# Altium project Delenda.PrjPcb
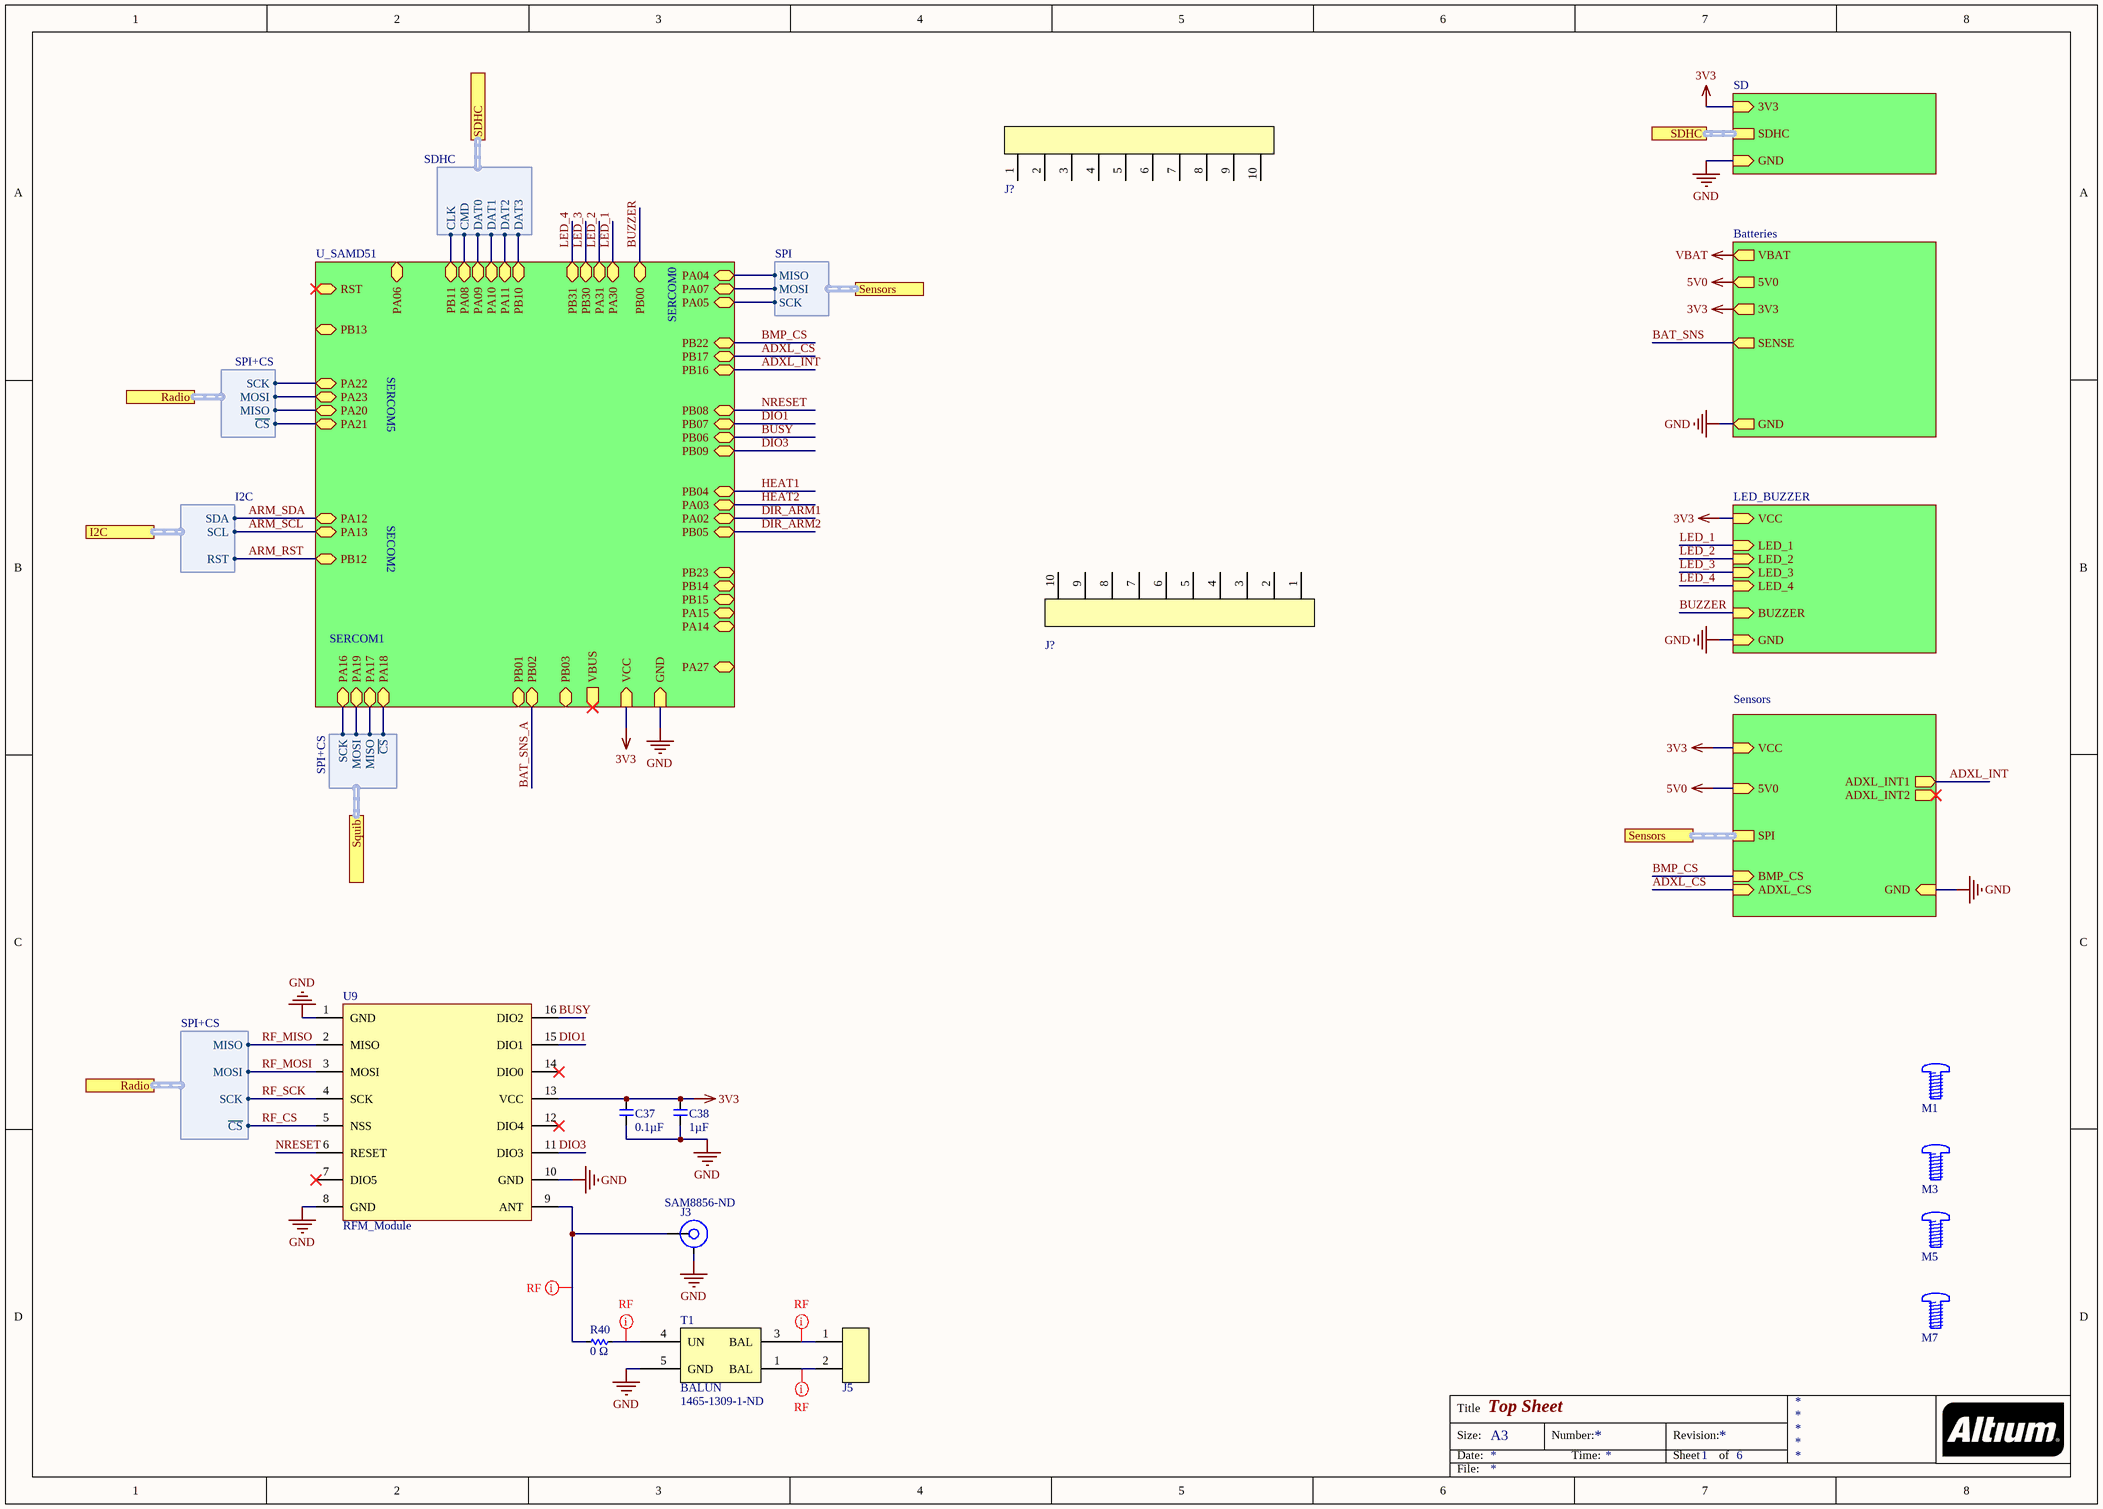
[diagram p0: Delenda.SchDoc]
prjEngineer1: John Dean; prjEngineer2: Rebecca Wong; prjReviewDate: 2016-10-31; prjReviewer: Sasha Maldonado; prjRevision: 0; prjTitle: IREC SRAD Altimeter
6 sheets, 83 parts. Net scope: strictly hierarchical (ports join the sheet entries above them; power ports are local).
Board file: Delenda.PcbDoc
Sheets:
  Delenda.SchDoc
    Sensors = Sensors.SchDoc
    Batteries = Battery_Management.SchDoc
    LED_BUZZER = Blink_Blink_Beep_Boop.SchDoc
    U_SAMD51 = SAMD51.SchDoc
    SD = SD.SchDoc

## Sheet Delenda.SchDoc: Top Sheet
size A3; SheetNumber: 1; SheetTotal: 6; DocumentName: Top Sheet

### Parts
(Parts that share a designator on the sheet are numbered #1, #2 ... from top to bottom, then left to right.)
C37  Capacitance (shorthand): 0.1µF  [C0603]  (hidden comment: __template_cap)
C38  Capacitance (shorthand): 1µF  [C0603]  (hidden comment: __template_cap)
J3  Supplier Part Number 1: SAM8856-ND  [SMA_SAMTEC_SMA-J-P-X-RA-TH1]  (hidden comment: SMA_SAMTEC_TH_RA)
J5  CONN HEADER 2POS VERT T/H  [CONN_1x2_100MIL]  (value not drawn)
J?#1  CONN HEADER 10POS T/H  [CONN_1x10_100MIL]  (value not drawn)
J?#2  CONN HEADER 10POS T/H  [CONN_1x10_100MIL]  (value not drawn)
M1  SCREW_#4-40  [#4_HOLE]  (value not drawn)
M3  SCREW_#4-40  [#4_HOLE]  (value not drawn)
M5  SCREW_#4-40  [#4_HOLE]  (value not drawn)
M7  SCREW_#4-40  [#4_HOLE]  (value not drawn)
R40  Resistance: 0 Ω  [R0402]  (hidden comment: __template_resistor)
T1  BALUN  Supplier Part Number 1: 1465-1309-1-ND  [BALUN_MABA-010245-CT1160]
U9  RFM_Module  [RFM-22]

### Sub-sheets
Batteries = Battery_Management: SENSE (out), 5V0 (out), GND (out), 3V3 (out), VBAT (out)
LED_BUZZER = Blink_Blink_Beep_Boop: LED_1 (in), LED_2 (in), LED_3 (in), LED_4 (in), BUZZER (in), GND (in), VCC (in)
SD = SD.SchDoc: SDHC (harness SDHC), GND (in), 3V3 (in)
Sensors = Sensors.SchDoc: SPI (harness SPI), BMP_CS (in), ADXL_CS (in), ADXL_INT1 (out), ADXL_INT2 (out), GND (in), VCC (in), 5V0 (in)
U_SAMD51 = SAMD51.SchDoc: PA12 (bidir), PA13 (bidir), PA05 (bidir), PA07 (bidir), PA04 (bidir), PA06 (bidir), PB11 (bidir), PA08 (bidir), PA09 (bidir), PA10 (bidir), PA11 (bidir), PB10 (bidir), PB12 (bidir), PB13 (bidir), PA22 (bidir), PA23 (bidir), PA16 (bidir), PA19 (bidir), PA17 (bidir), PA20 (bidir), PA21 (bidir), PB08 (bidir), PB07 (bidir), PB06 (bidir), PB09 (bidir), PB04 (bidir), PA03 (bidir), PA02 (bidir), PB05 (bidir), PB00 (bidir), PB30 (bidir), PA31 (bidir), PA30 (bidir), PB31 (bidir), PB16 (bidir), PA14 (bidir), PB17 (bidir), PB23 (bidir), PB22 (bidir), PA27 (bidir), PB02 (bidir), PB01 (bidir), PB03 (bidir), PA18 (bidir), GND (in), VCC (in), VBUS (out), PB14 (bidir), PB15 (bidir), PA15 (bidir), RST (bidir)

### Ports
I2C (harness I2C), Radio (harness SPI+CS), SDHC, SDHC (harness SDHC), Sensors (harness SPI), Squib (harness SPI+CS)

### Harnesses
SPI: MISO, MOSI, SCK
SDHC: CLK, CMD, DAT0, DAT1, DAT2, DAT3
SPI+CS: MISO, MOSI, SCK, ~{CS}
I2C: SCL, SDA, RST

### Nets
3V3: C37.1 C38.1 U9.13(VCC) ; sheet Sensors/VCC, sheet Batteries/3V3, sheet LED_BUZZER/VCC, sheet U_SAMD51/VCC, sheet SD/3V3
5V0: sheet Sensors/5V0, sheet Batteries/5V0
GND: C37.2 C38.2 J3.GND T1.5(GND) U9.1(GND) U9.8(GND) U9.10(GND) ; sheet Sensors/GND, sheet Batteries/GND, sheet LED_BUZZER/GND, sheet U_SAMD51/GND, sheet SD/GND
ADXL_CS: sheet Sensors/ADXL_CS, sheet U_SAMD51/PB17
ADXL_INT: sheet Sensors/ADXL_INT1, sheet U_SAMD51/PB16
ARM_RST: sheet U_SAMD51/PB12, port I2C.RST
ARM_SCL: sheet U_SAMD51/PA13, port I2C.SCL
ARM_SDA: sheet U_SAMD51/PA12, port I2C.SDA
BMP_CS: sheet Sensors/BMP_CS, sheet U_SAMD51/PB22
BUSY: U9.16(DIO2) ; sheet U_SAMD51/PB06
BUZZER: sheet LED_BUZZER/BUZZER, sheet U_SAMD51/PB00
DIO1: U9.15(DIO1) ; sheet U_SAMD51/PB07
DIO3: U9.11(DIO3) ; sheet U_SAMD51/PB09
LED_1: sheet LED_BUZZER/LED_1, sheet U_SAMD51/PA30
LED_2: sheet LED_BUZZER/LED_2, sheet U_SAMD51/PA31
LED_3: sheet LED_BUZZER/LED_3, sheet U_SAMD51/PB30
LED_4: sheet LED_BUZZER/LED_4, sheet U_SAMD51/PB31
MISO: sheet U_SAMD51/PA04, port Sensors.MISO
MOSI: sheet U_SAMD51/PA07, port Sensors.MOSI
NRESET: U9.6(RESET) ; sheet U_SAMD51/PB08
RF_CS: U9.5(NSS) ; sheet U_SAMD51/PA21, port Radio.~{CS}
RF_MISO: U9.2(MISO) ; sheet U_SAMD51/PA20, port Radio.MISO
RF_MOSI: U9.3(MOSI) ; sheet U_SAMD51/PA23, port Radio.MOSI
RF_SCK: U9.4(SCK) ; sheet U_SAMD51/PA22, port Radio.SCK
SCK: sheet U_SAMD51/PA05, port Sensors.SCK
SD_CLK: sheet U_SAMD51/PB11, port SDHC.CLK
SD_CMD: sheet U_SAMD51/PA08, port SDHC.CMD
SD_DAT0: sheet U_SAMD51/PA09, port SDHC.DAT0
SD_DAT1: sheet U_SAMD51/PA10, port SDHC.DAT1
SD_DAT2: sheet U_SAMD51/PA11, port SDHC.DAT2
SD_DAT3: sheet U_SAMD51/PB10, port SDHC.DAT3
NetJ3_SIG: J3.SIG R40.1 U9.9(ANT)
NetJ5_1: J5.1 T1.3(BAL)
NetJ5_2: J5.2 T1.1(BAL)
NetR40_2: R40.2 T1.4(UN)
NetU7_35: sheet U_SAMD51/PA16, port Squib.SCK
NetU7_36: sheet U_SAMD51/PA17, port Squib.MISO
NetU7_37: sheet U_SAMD51/PA18, port Squib.~{CS}
NetU7_38: sheet U_SAMD51/PA19, port Squib.MOSI

Not connected (* = marked no-connect by the designer): J?#1 1 2 3 4 5 6 7 8 9 10; J?#2 1 2 3 4 5 6 7 8 9 10; M1 HOLE(0); M3 HOLE(0); M5 HOLE(0); M7 HOLE(0); U9 7(DIO5)* 12(DIO4)* 14(DIO0)*

### Buses and harness runs
harness port SDHC = sheet SD/SDHC
harness port Sensors = sheet Sensors/SPI

### Layout directives
rule Clearance Constraint [Generic clearance = 0mil, and 21 value(s) for objects]: NetJ3_SIG, NetJ5_1, NetJ5_2, NetR40_2

### Notes on the sheet
- SERCOM0
- SERCOM5
- SECOM2
- SERCOM1
- Title
- Size:
- Date:
- A3
- Number:
- Time:
- Revision:
- Sheet
- of
- File:

### Library data of the parts
C37 = 490-1519-1-ND: CAP CER 0603 0.1µF X7R 50V 10%; Manufacturer: Murata Electronics North America; Capacitance - pF (Machine readable): #NAME?; type: capacitor; Rated Voltage: 50V; Supplier Part Number 1: 490-1519-1-ND; Dielectric: X7R; Supplier 1: Digikey
C38 = 490-3900-1-ND: CAP CER 0603 1µF X7R 16V 10%; Manufacturer: Murata Electronics North America; Capacitance - pF (Machine readable): #NAME?; type: capacitor; Rated Voltage: 16V; Supplier Part Number 1: 490-3900-1-ND; Dielectric: X7R; Supplier 1: Digikey
J5 = CONN_1x2: Manufacturer: FCI; Manufacturer Part Number: 77311-118-02LF; Connector Type: Header, Unshrouded; Number of Positions: 2; Number of Positions Loaded: All; Pitch: 0.100" (2.54mm); RoHS: RoHS Compliant; Category: Connectors, Interconnects; Contact Type: Male Pin; Number of Rows: 1; Row Spacing: -; Contact Mating Length: 0.230" (5.84mm); Mounting Type: Through Hole; Termination: Solder; Fastening Type: -; Features: -; Contact Finish: Gold, GXT™; Contact Finish Thickness: 30µin (0.76µm); Color: Black; Packaging: Bulk; ComponentLink1URL: http://portal.fciconnect.com/res/en/pdffiles/doc_search//77311.pdf; ComponentLink1Description: http://portal.fciconnect.com/res/en/pdffiles/doc_search//77311.pdf
J?#1 J?#2 = CONN_1x10
M1 M3 M5 M7 = SCREW_#4-40: #4-40 Button Head Screw
R40 = 311-0.0LRCT-ND: RES SMD 0 OHM JUMPER 1/16W 0402; Manufacturer Part Number: RC0402FR-070RL; Manufacturer: Yageo; Resistance (Sortable): 0; Power (Watts): 0.063W, 1/16W; Supplier Part Number 1: 311-0.0LRCT-ND; Supplier 1: Digikey; Datasheets: http://www.yageo.com/documents/recent/PYu-RC_Group_51_RoHS_L_9.pdf; Image: //media.digikey.com/Renders/Yageo%20Renders/0402-(1005-Metric).jpg; Tolerance: Jumper; Temperature Coefficient: -; Operating Temperature: -55°C ~ 155°C
J3 = SMA_SAMTEC_TH_RA: Supplier 1: Digi-Key
T1 = BALUN: Supplier 1: Digi-Key

## Sheet Sensors.SchDoc
size A4
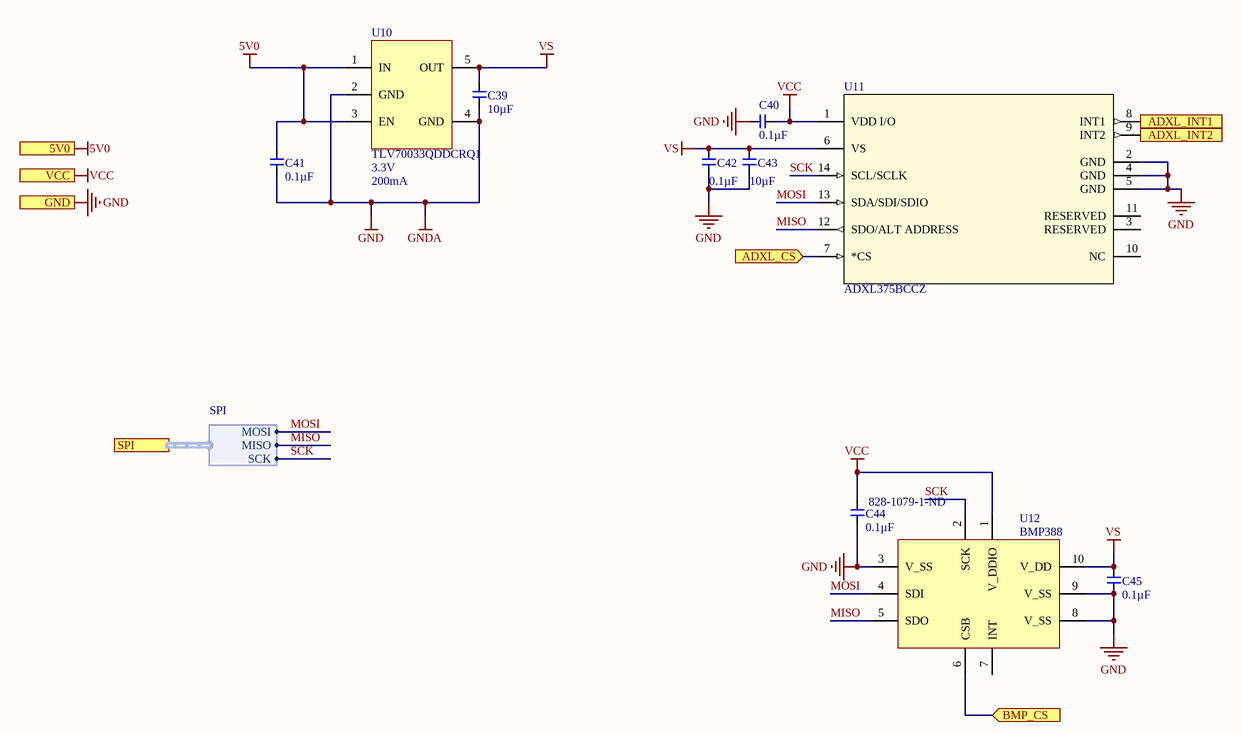
[diagram p1: Sensors.SchDoc]

### Parts
C39  Capacitance (shorthand): 10µF  [C0603]  (hidden comment: __template_cap)
C40  Capacitance (shorthand): 0.1µF  [C0603]  (hidden comment: __template_cap)
C41  Capacitance (shorthand): 0.1µF  [C0603]  (hidden comment: __template_cap)
C42  Capacitance (shorthand): 0.1µF  [C0603]  (hidden comment: __template_cap)
C43  Capacitance (shorthand): 10µF  [C0603]  (hidden comment: __template_cap)
C44  Capacitance (shorthand): 0.1µF  [C0603]  (hidden comment: __template_cap)
C45  Capacitance (shorthand): 0.1µF  [C0603]  (hidden comment: __template_cap)
U10  Manufacturer Part Number: TLV70033QDDCRQ1  Voltage - Output: 3.3V  Current - Output: 200mA  [5SOT23]  (hidden comment: LDO_TLV70033QDDCRQ1)
U11  ADXL375BCCZ  [LGA_CC-14-1]
U12  BMP388  Supplier Part Number 1: 828-1079-1-ND  [8 pin LGA]

### Ports
5V0 (in), ADXL_CS (in), ADXL_INT1 (out), ADXL_INT2 (out), BMP_CS (in), GND (in), SPI (harness SPI), VCC (in)

### Harnesses
SPI: MISO, MOSI, SCK

### Nets
5V0: C41.1 U10.1(IN) U10.3(EN) ; port 5V0
GND: C39.2 C40.2 C41.2 C42.1 C43.2 C44.2 C45.2 U10.2(GND) U10.4(GND) U11.2(GND) U11.4(GND) U11.5(GND) U12.3(V_SS) U12.8(V_SS) U12.9(V_SS) ; port GND  [also labelled GNDA]
VCC: C40.1 C44.1 U11.1(VDD_I/O) U12.1(V_DDIO) ; port VCC  [project net 3V3]
VS: C39.1 C42.2 C43.1 C45.1 U10.5(OUT) U11.6(VS) U12.10(V_DD)
ADXL_CS: U11.7(*CS) ; port ADXL_CS
ADXL_INT: U11.8(INT1) ; port ADXL_INT1
BMP_CS: U12.6(CSB) ; port BMP_CS
MISO: U11.12(SDO/ALT_ADDRESS) U12.5(SDO) ; port SPI.MISO
MOSI: U11.13(SDA/SDI/SDIO) U12.4(SDI) ; port SPI.MOSI
SCK: U11.14(SCL/SCLK) U12.2(SCK) ; port SPI.SCK
NetU11_9: U11.9(INT2) ; port ADXL_INT2

Not connected (* = marked no-connect by the designer): U11 3(RESERVED) 10(NC) 11(RESERVED); U12 7(INT)

### Notes on the sheet
- Title
- Size:
- Date:
- A4
- Number:
- Time:
- Revision:
- Sheet
- of
- File:

### Library data of the parts
C39 C43 = 490-13248-1-ND: CAP CER 10UF 35V X5R 0603 20%; Manufacturer: Murata Electronics North America; Capacitance - pF (Machine readable): #NAME?; type: capacitor; Dielectric: X5R; Supplier 1: Digikey; Supplier Part Number 1: 490-13248-1-ND; Rated Voltage: 35V
C40-C42 C44 C45 = 490-1519-1-ND: as C37 on sheet Delenda; Dielectric: X7R; Supplier 1: Digikey; Supplier Part Number 1: 490-1519-1-ND; Rated Voltage: 50V
U10 = LDO_TLV70033QDDCRQ1: IC REG LDO 3.3V .2A SOT23-5; Manufacturer: Texas Instruments; Regulator Topology: Positive Fixed; Number of Regulators: 1; Voltage - Input: Up to 5.5V; Current - Limit (Min): 220mA; ComponentLink1URL: http://www.ti.com/lit/ds/symlink/tlv70033-q1.pdf; ComponentLink1Description: Datasheet; Supplier 1: Digi-Key; RoHS: RoHS Compliant; Category: Integrated Circuits (ICs); Stock 1: 889; Pricing 1: 1=0.58, 10=0.507, 25=0.444, 100=0.1661, 250=0.16296, 500=0.1599, 750=0.15683 (USD); Packaging: Cut Tape (CT); Voltage - Dropout (Typical): -; Operating Temperature: -40°C ~ 125°C; Mounting Type: Surface Mount; Package / Case: SOT-23-5 Thin, TSOT-23-5; Supplier Device Package: SOT-5; Supplier Part Number 1: 296-27780-1-ND
U11 = ADXL375BCCZ: 200G Accelcerometer; Manufacturer: Analog Devices; Manufacturer Part Number: ADXL375BCCZ-RL7; Bandwidth: 1kHz; Interface: I2C,SPI; Nominal Supply Current: 145uA; -3db Bandwidth: 1.6kHz; Output Type: Digital; Axis: X, Y, Z; Sensitivity: 20.5LSB/g; Operating Supply Voltage: 3.6V; Value: Value; Type: Type; RefDes: RefDes; ComponentLink1Description: Datasheet; ComponentLink1URL: http://www.analog.com/media/en/technical-documentation/data-sheets/ADXL375.PDF; Supplier 1: Digi-Key; Stock 1: 3410; Pricing 1: 1=10.9, 10=10.021, 100=8.463, 500=7.5284 (USD); Mount: Surface Mount; Number of Pins: 14; Min Operating Temperature: -40°C; Max Operating Temperature: 85°C; Package Quantity: 1; Operating Supply Current: 145uA; Lead Free: Contains Lead; Supplier Part Number 1: ADXL375BCCZ-RL7CT-ND
U12 = BMP388: SENSOR PRESSURE ABS; Manufacturer: Bosch Sensortec; Supplier 1: Digi-Key; Manufacturer Part Number: BMP388; Stock 1: 46050; Pricing 1: 1=3.93, 5=3.466, 10=3.061, 25=2.4832, 50=2.1946, 100=2.1368, 500=1.7903, 1000=1.6748, 5000=1.5593 (USD); ComponentLink1URL: https://ae-bst.resource.bosch.com/media/_tech/media/product_flyer/BST-BMP388-FL000-00.pdf; ComponentLink1Description: https://ae-bst.resource.bosch.com/media/_tech/media/product_flyer/BST-BMP388-FL000-00.pdf

## Sheet Battery_Management.SchDoc: Battery Management
size A3; SheetNumber: 4; SheetTotal: 6
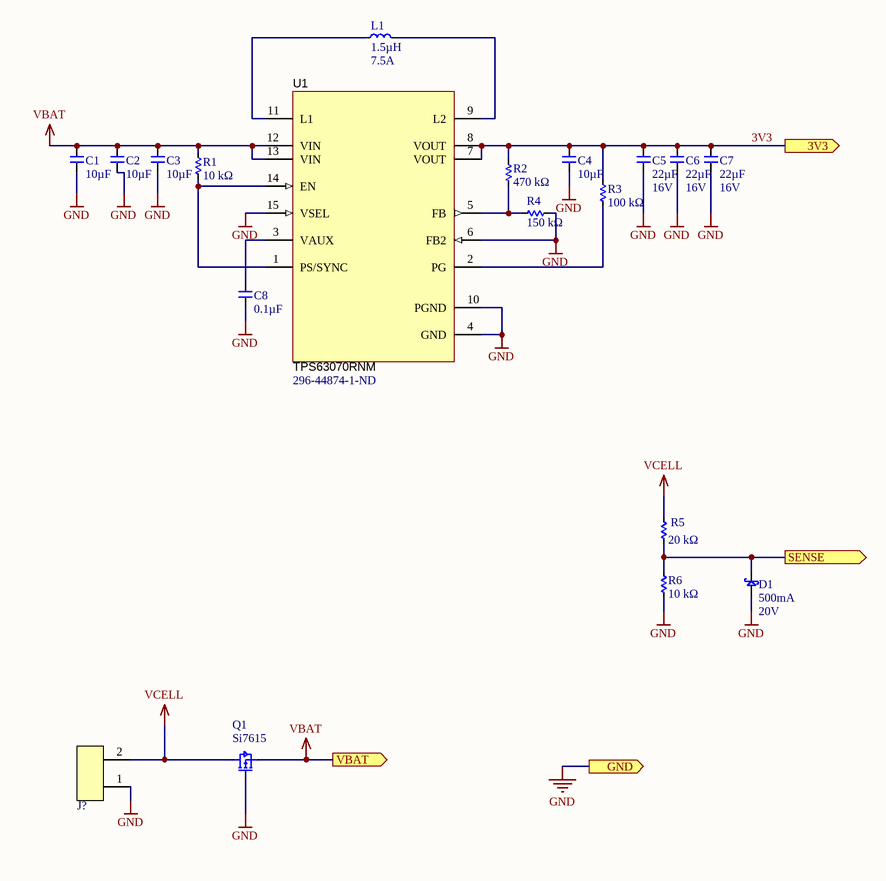
[diagram p2: Battery_Management.SchDoc]

### Parts
(Parts that share a designator on the sheet are numbered #1, #2 ... from top to bottom, then left to right.)
C1  Capacitance (shorthand): 10µF  [C0603]  (hidden comment: __template_cap)
C2  Capacitance (shorthand): 10µF  [C0603]  (hidden comment: __template_cap)
C3  Capacitance (shorthand): 10µF  [C0603]  (hidden comment: __template_cap)
C4  Capacitance (shorthand): 10µF  [C0603]  (hidden comment: __template_cap)
C5  Capacitance (shorthand): 22µF  Rated Voltage: 16V  [C0603]  (hidden comment: __template_cap)
C6  Capacitance (shorthand): 22µF  Rated Voltage: 16V  [C0603]  (hidden comment: __template_cap)
C7  Capacitance (shorthand): 22µF  Rated Voltage: 16V  [C0603]  (hidden comment: __template_cap)
C8  Capacitance (shorthand): 0.1µF  [C0603]  (hidden comment: __template_cap)
D1  Current - Average Rectified (Io): 500mA  Voltage - DC Reverse (Vr) (Max): 20V  [SOD123]  (hidden comment: SCHOTTKY_MBR0520L)
J?#3  CONN HEADER 2POS VERT T/H  [CONN_1x2_100MIL]  (value not drawn)
L1  Inductance: 1.5µH  Current Rating: 7.5A  [SMD5230]  (hidden comment: IND_IHLP2020CZER1R5M11)
Q1  Si7615  [POWERPAK_1212-8_SINGLE]
R1  Resistance: 10 kΩ  [R0603]  (hidden comment: __template_resistor)
R2  Resistance: 470 kΩ  [R0603]  (hidden comment: __template_resistor)
R3  Resistance: 100 kΩ  [R0603]  (hidden comment: __template_resistor)
R4  Resistance: 150 kΩ  [R0603]  (hidden comment: __template_resistor)
R5  Resistance: 20 kΩ  [R0603]  (hidden comment: __template_resistor)
R6  Resistance: 10 kΩ  [R0603]  (hidden comment: __template_resistor)
U1  TPS63070RNM  Supplier Part Number 1: 296-44874-1-ND  [TPS63070]

### Ports
3V3 (out), GND (out), SENSE (out), VBAT (out)

### Nets
3V3: C4.1 C5.1 C6.1 C7.1 R2.2 R3.2 U1.7(VOUT) U1.8(VOUT) ; port 3V3
GND: C1.2 C2.2 C3.2 C4.2 C5.2 C6.2 C7.2 C8.2 D1.1 J?#3.1 Q1.1 R4.2 R6.1 U1.4(GND) U1.6(FB2) U1.10(PGND) U1.15(VSEL) ; port GND
VBAT: C1.1 C2.1 C3.1 Q1.2 R1.2 U1.12(VIN) U1.13(VIN) ; port VBAT
VCELL: J?#3.2 Q1.3 R5.2
BAT_SNS: D1.2 R5.1 R6.2 ; port SENSE
NetC8_1: C8.1 U1.3(VAUX)
NetL1_1: L1.1 U1.11(L1)
NetL1_2: L1.2 U1.9(L2)
NetR1_1: R1.1 U1.1(PS/SYNC) U1.14(EN)
NetR2_1: R2.1 R4.1 U1.5(FB)
NetR3_1: R3.1 U1.2(PG)

### Notes on the sheet
- Title
- Size:
- Date:
- A3
- Number:
- Time:
- Revision:
- Sheet
- of
- File:

### Library data of the parts
C1-C4 = 490-13248-1-ND: as C39 on sheet Sensors; Rated Voltage: 35V; Dielectric: X5R; Supplier 1: Digikey; Supplier Part Number 1: 490-13248-1-ND
C5-C7 = 1276-7076-1-ND: CAP CER 22UF 16V X5R 0603 20%; Manufacturer: Samsung Electro-Mechanics; Capacitance - pF (Machine readable): #NAME?; type: capacitor; Dielectric: X5R; Supplier 1: Digikey; Supplier Part Number 1: 1276-7076-1-ND
C8 = 490-1519-1-ND: as C37 on sheet Delenda; Rated Voltage: 50V; Dielectric: X7R; Supplier 1: Digikey; Supplier Part Number 1: 490-1519-1-ND
D1 = SCHOTTKY_MBR0520L: DIODE SCHOTTKY 0.5A 20V SOD-123; Manufacturer: Fairchild Semiconductor; Speed: Fast Recovery =< 500ns, > 200mA (Io); Current - Reverse Leakage @ Vr: 250µA @ 20V; Voltage - Forward (Vf) (Max) @ If: 385mV @ 500mA; Supplier 1: Digi-Key; Manufacturer Part Number: MBR0520L; RoHS: RoHS Compliant; Category: Discrete Semiconductor Products; Stock 1: 217232; Pricing 1: 1=0.63, 10=0.43, 100=0.2024, 250=0.1442, 500=0.11006, 750=0.08603, 1000=0.0759 (USD); Diode Type: Schottky; Reverse Recovery Time (trr): -; Capacitance @ Vr, F: -; Mounting Type: Surface Mount; Package / Case: SOD-123; Supplier Device Package: SOD-123; Packaging: Cut Tape (CT); ComponentLink1URL: http://www.fairchildsemi.com/ds/MB/MBR0520L.pdf; ComponentLink1Description: Datasheet; Supplier Part Number 1: MBR0520LCT-ND
J?#3 = CONN_1x2: as J5 on sheet Delenda; RoHS: RoHS Compliant; Category: Connectors, Interconnects; Contact Type: Male Pin; Number of Rows: 1; Row Spacing: -; Contact Mating Length: 0.230" (5.84mm); Mounting Type: Through Hole; Termination: Solder; Fastening Type: -; Features: -; Contact Finish: Gold, GXT™; Contact Finish Thickness: 30µin (0.76µm); Color: Black; Packaging: Bulk; ComponentLink1URL: http://portal.fciconnect.com/res/en/pdffiles/doc_search//77311.pdf; ComponentLink1Description: http://portal.fciconnect.com/res/en/pdffiles/doc_search//77311.pdf
L1 = IND_IHLP2020CZER1R5M11: INDUCTOR POWER 1.5UH 7.5A SMD; Manufacturer: Vishay Dale; Current - Saturation: 7A; Tolerance: ±20%; Shielding: Shielded; DC Resistance (DCR): 18.5 mOhm Max; Frequency - Test: 100kHz; Supplier 1: Digi-Key; Manufacturer Part Number: IHLP2020CZER1R5M11; RoHS: RoHS Compliant; Category: Inductors, Coils, Chokes; Stock 1: 17936; Pricing 1: 1=2.29, 10=1.86, 100=1.55, 500=1.24, 1000=1.116 (USD); Type: -; Material - Core: -; Q @ Freq: -; Frequency - Self Resonant: -; Operating Temperature: -55°C ~ 125°C; Package / Case: Non Standard; Size / Dimension: 0.216" L x 0.204" W x 0.118" H (5.49mm x 5.18mm x 3.00mm); Mounting Type: Surface Mount; Packaging: Cut Tape (CT); ComponentLink1URL: http://www.vishay.com/docs/34260/lp20cz11.pdf; ComponentLink1Description: Datasheet; Supplier Part Number 1: 541-1235-1-ND
Q1 = PFET_SI7615ADN-T1: MOSFET P-CH 20V 35A PPK; pin to pad: 1>4 2>1 3>5; Manufacturer: Vishay Siliconix; Manufacturer Part Number: SI7615ADN-T1-GE3; FET Type: MOSFET P-Channel, Metal Oxide; FET Feature: Standard; Current - Continuous Drain (Id) @ 25°C: 35A (Tc); Rds On (Max) @ Id, Vgs: 4.4 mOhm @ 20A, 10V; Vgs(th) (Max) @ Id: 1.5V @ 250µA; Gate Charge (Qg) @ Vgs: 183nC @ 10V; Input Capacitance (Ciss) @ Vds: 5590pF @ 10V; Power - Max: 52W; Supplier 1: Digi-Key; Supplier Part Number 1: SI7615ADN-T1-GE3CT-ND; RoHS: RoHS Compliant; Category: Discrete Semiconductor Products; Stock 1: 98451; Pricing 1: 1=0.73, 10=0.646, 25=0.6068, 100=0.4951, 250=0.45988, 500=0.3914, 1000=0.31312 (USD); Packaging: Cut Tape (CT); Part Status: Active; Drain to Source Voltage (Vdss): 20V; Operating Temperature: -55°C ~ 150°C (TJ); Mounting Type: Surface Mount; Package / Case: PowerPAK® 1212-8; Supplier Device Package: PowerPAK® 1212-8; ComponentLink1URL: http://www.vishay.com/docs/62667/si7615adn.pdf; ComponentLink1Description: http://www.vishay.com/docs/62667/si7615adn.pdf
R1 R6 = 311-10.0KHRCT-ND: RES SMD 10K OHM 1% 1/10W 0603; Manufacturer Part Number: RC0603FR-0710KL; Manufacturer: Yageo; Resistance (Sortable): 10000; Power (Watts): 0.1W, 1/10W; Temperature Coefficient: ±100ppm/°C; Supplier 1: Digikey; Datasheets: http://www.yageo.com/documents/recent/PYu-RC_Group_51_RoHS_L_9.pdf; Image: //media.digikey.com/Renders/Yageo%20Renders/0603-(1608-Metric).jpg; Supplier Part Number 1: 311-10.0KHRCT-ND; Tolerance: ±1%; Operating Temperature: -55°C ~ 155°C
R2 = 311-470KHRCT-ND: RES SMD 470K OHM 1% 1/10W 0603; Manufacturer Part Number: RC0603FR-07470KL; Manufacturer: Yageo; Power (Watts): 0.1W, 1/10W; Resistance (Sortable): 470000; Temperature Coefficient: ±100ppm/°C; Tolerance: ±1%; Supplier 1: Digikey; Datasheets: http://www.yageo.com/documents/recent/PYu-RC_Group_51_RoHS_L_9.pdf; Image: //media.digikey.com/Renders/Yageo%20Renders/0603-(1608-Metric).jpg; Supplier Part Number 1: 311-470KHRCT-ND; Operating Temperature: -55°C ~ 155°C
R3 = 311-100KHRCT-ND: RES SMD 100K OHM 1% 1/10W 0603; Manufacturer Part Number: RC0603FR-07100KL; Manufacturer: Yageo; Power (Watts): 0.1W, 1/10W; Resistance (Sortable): 100000; Temperature Coefficient: ±100ppm/°C; Tolerance: ±1%; Supplier 1: Digikey; Datasheets: http://www.yageo.com/documents/recent/PYu-RC_Group_51_RoHS_L_9.pdf; Image: //media.digikey.com/Renders/Yageo%20Renders/0603-(1608-Metric).jpg; Supplier Part Number 1: 311-100KHRCT-ND; Operating Temperature: -55°C ~ 155°C
R4 = 311-150KHRCT-ND: RES SMD 150K OHM 1% 1/10W 0603; Manufacturer Part Number: RC0603FR-07150KL; Manufacturer: Yageo; Power (Watts): 0.1W, 1/10W; Resistance (Sortable): 150000; Temperature Coefficient: ±100ppm/°C; Tolerance: ±1%; Supplier 1: Digikey; Datasheets: http://www.yageo.com/documents/recent/PYu-RC_Group_51_RoHS_L_9.pdf; Image: //media.digikey.com/Renders/Yageo%20Renders/0603-(1608-Metric).jpg; Supplier Part Number 1: 311-150KHRCT-ND; Operating Temperature: -55°C ~ 155°C
R5 = 311-20.0KHRCT-ND: RES SMD 20K OHM 1% 1/10W 0603; Manufacturer Part Number: RC0603FR-0720KL; Manufacturer: Yageo; Resistance (Sortable): 20000; Power (Watts): 0.1W, 1/10W; Temperature Coefficient: ±100ppm/°C; Supplier 1: Digikey; Datasheets: http://www.yageo.com/documents/recent/PYu-RC_Group_51_RoHS_L_9.pdf; Image: //media.digikey.com/Renders/Yageo%20Renders/0603-(1608-Metric).jpg; Supplier Part Number 1: 311-20.0KHRCT-ND; Tolerance: ±1%; Operating Temperature: -55°C ~ 155°C
U1 = TPS63070RNM: BUCKBOOST TPS63070RNM, RNM0015A; Manufacturer: Texas Instruments; Manufacturer Part Number: TPS63070RNMR; SymbolCreator: Altium; SizeX_mm: 2.5; SizeY_mm: 3; SizeZ_mm: 1; CompType: IC; U/M: EA; Quiescent Current: 50uA; Min Input Voltage: 2V; Max Input Voltage: 16V; Output Current: 2A; Switching Frequency: 2.4MHz; Topology: Buck-Boost; Min Output Voltage: 2.5V; Max Output Voltage: 9V; Synchronous Rectifier: Yes; Output Type: Adjustable; Output Configuration: Positive; SymbolVersion: 2015-05-01; PartNumber: TPS63070RNM; PackageReference: RNM0015A; PackageDescription: VQFN-HR-15; MountType: SMT; ComponentLink1Description: Datasheet Link; ComponentLink1URL: https://sps06.itg.ti.com/sites/KMS/crossdivteams/altium/docs/ComponentDatasheets/TPS63070_datasheet_23_April2015.pdf; Publisher: Texas Instruments; LatestRevisionDate: 2016-05-12; Alternate Manufacturer: Texas Instruments; Supplier 1: Digi-Key; Stock 1: 16230; Pricing 1: 1=2.67, 10=2.402, 100=1.9306, 500=1.5862, 1000=1.31428 (USD); Mount: Surface Mount; Case/Package: VQFN; Number of Pins: 15; Min Operating Temperature: -40°C; Max Operating Temperature: 125°C; Packaging: Tape and Reel; Number of Outputs: 1; Lead Free: Lead Free

## Sheet Blink_Blink_Beep_Boop.SchDoc: External Indicators
size A4; SheetNumber: 5; SheetTotal: 6
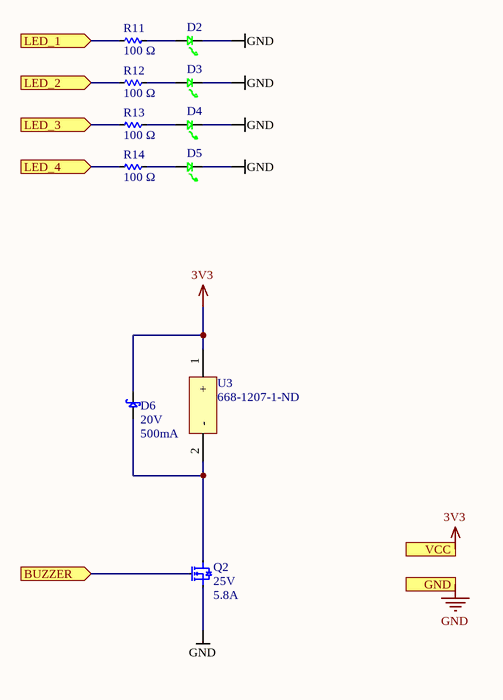
[diagram p3: Blink_Blink_Beep_Boop.SchDoc]

### Parts
D2  LED_LY971  [0805_Diode]  (value not drawn)
D3  LED_LY971  [0805_Diode]  (value not drawn)
D4  LED_LY971  [0805_Diode]  (value not drawn)
D5  LED_LY971  [0805_Diode]  (value not drawn)
D6  Voltage - DC Reverse (Vr) (Max): 20V  Current - Average Rectified (Io): 500mA  [SOD123]  (hidden comment: SCHOTTKY_MBR0520L)
Q2  Drain to Source Voltage (Vdss): 25V  Current - Continuous Drain (Id) @ 25° C: 5.8A  [3SOT23]  (hidden comment: NFET_IRFML8244TRPBF)
R11  Resistance: 100 Ω  [R0603]  (hidden comment: __template_resistor)
R12  Resistance: 100 Ω  [R0603]  (hidden comment: __template_resistor)
R13  Resistance: 100 Ω  [R0603]  (hidden comment: __template_resistor)
R14  Resistance: 100 Ω  [R0603]  (hidden comment: __template_resistor)
U3  Supplier Part Number 1: 668-1207-1-ND  [BUZ_SMT-0540-T-7-R]  (hidden comment: BUZ_SMT-0540-T-7-R)

### Ports
BUZZER (in), GND (in), LED_1 (in), LED_2 (in), LED_3 (in), LED_4 (in), VCC (in)

### Nets
3V3: D6.2 U3.1(+) ; port VCC
GND: D2.1 D3.1 D4.1 D5.1 Q2.2 ; port GND
BUZZER: Q2.1 ; port BUZZER
LED_1: R11.1 ; port LED_1
LED_2: R12.1 ; port LED_2
LED_3: R13.1 ; port LED_3
LED_4: R14.1 ; port LED_4
NetD2_2: D2.2 R11.2
NetD3_2: D3.2 R12.2
NetD4_2: D4.2 R13.2
NetD5_2: D5.2 R14.2
NetD6_1: D6.1 Q2.3 U3.2(-)

### Notes on the sheet
- Title
- Size:
- Date:
- A4
- Number:
- Time:
- Revision:
- Sheet
- of
- File:

### Library data of the parts
D2-D5 = LED_LY971: LED 0805 GREEN 20MA; Manufacturer: OSRAM Opto Semiconductors Inc; Manufacturer Part Number: LG R971-KN-1; Wavelength - Dominant: 570nm; Wavelength - Peak: 572nm; Millicandela Rating: 26.05mcd; Voltage - Forward (Vf) (Typ): 2.2V; Viewing Angle: 160°; Lens Transparency: Diffused; Lens Color: White; Lens Style/Size: Rectangle with Flat Top, 1.30mm x 1.25mm; Supplier 1: Digi-Key; RoHS: RoHS Compliant; Category: Optoelectronics; Stock 1: 89733; Pricing 1: 1=0.08, 10=0.069, 100=0.0548, 250=0.04796, 500=0.04384 (USD); Packaging: Cut Tape (CT); Color: Green; Package / Case: 0805 (2012 Metric); Supplier Device Package: *; Size / Dimension: 2.00mm L x 1.25mm W; Height (Max): 0.80mm; Mounting Type: Surface Mount; ComponentLink1URL: http://www.osram-os.com/Graphics/XPic9/00078860_0.pdf; ComponentLink1Description: http://www.osram-os.com/Graphics/XPic9/00078860_0.pdf; Supplier Part Number 1: 475-1410-1-ND; Current - Test: 20mA
D6 = SCHOTTKY_MBR0520L: DIODE SCHOTTKY 0.5A 20V SOD-123; Manufacturer: Fairchild Semiconductor; Voltage - Forward (Vf) (Max) @ If: 385mV @ 500mA; Speed: Fast Recovery =< 500ns, > 200mA (Io); Current - Reverse Leakage @ Vr: 250µA @ 20V; Supplier 1: Digi-Key; Manufacturer Part Number: MBR0520L; RoHS: RoHS Compliant; Category: Discrete Semiconductor Products; Stock 1: 217232; Pricing 1: 1=0.63, 10=0.43, 100=0.2024, 250=0.1442, 500=0.11006, 750=0.08603, 1000=0.0759 (USD); Diode Type: Schottky; Reverse Recovery Time (trr): -; Capacitance @ Vr, F: -; Mounting Type: Surface Mount; Package / Case: SOD-123; Supplier Device Package: SOD-123; Packaging: Cut Tape (CT); ComponentLink1URL: http://www.fairchildsemi.com/ds/MB/MBR0520L.pdf; ComponentLink1Description: Datasheet; Supplier Part Number 1: MBR0520LCT-ND
Q2 = NFET_IRFML8244TRPBF: MOSFET N-CH 25V 5.8A SOT23; Manufacturer: International Rectifier; FET Type: MOSFET N-Channel, Metal Oxide; FET Feature: Logic Level Gate; Rds On (Max) @ Id, Vgs: 24 mOhm @ 5.8A, 10V; Vgs(th) (Max) @ Id: 2.35V @ 10µA; Gate Charge (Qg) @ Vgs: 5.4nC @ 10V; Input Capacitance (Ciss) @ Vds: 430pF @ 10V; Power - Max: 1.25W; Supplier 1: Digi-Key; Manufacturer Part Number: IRFML8244TRPBF; RoHS: RoHS Compliant; Category: Discrete Semiconductor Products; Stock 1: 13542; Pricing 1: 1=0.41, 10=0.23, 100=0.1491, 250=0.13548, 500=0.1219, 1000=0.11411 (USD); Mounting Type: Surface Mount; Package / Case: TO-236-3, SC-59, SOT-23-3; Supplier Device Package: SOT-23; Packaging: Cut Tape (CT); ComponentLink1URL: http://www.irf.com/product-info/datasheets/data/irfml8244pbf.pdf; ComponentLink1Description: Datasheet; Supplier Part Number 1: IRFML8244TRPBFCT-ND
R11-R14 = 311-100HRCT-ND: RES SMD 100 OHM 1% 1/10W 0603; Manufacturer Part Number: RC0603FR-07100RL; Manufacturer: Yageo; Power (Watts): 0.1W, 1/10W; Resistance (Sortable): 100; Temperature Coefficient: ±100ppm/°C; Tolerance: ±1%; Supplier 1: Digikey; Datasheets: http://www.yageo.com/documents/recent/PYu-RC_Group_51_RoHS_L_9.pdf; Image: //media.digikey.com/Renders/Yageo%20Renders/0603-(1608-Metric).jpg; Supplier Part Number 1: 311-100HRCT-ND; Operating Temperature: -55°C ~ 155°C
U3 = BUZ_SMT-0540-T-7-R: Peak-Peak Signal Buzzer Single Tone 4kHz Magnetic 2 ~ 4V 78dB @ 3V, 10cm; Manufacturer: PUI Audio, Inc.; Driver Circuitry: Transducer, Externally Driven; Voltage Range: 2 ~ 4V; Current - Supply: 100mA; Port Location: Top; Supplier 1: Digi-Key; Manufacturer Part Number: SMT-0540-T-7-R; RoHS: RoHS Compliant; Category: Audio Products; Stock 1: 12397; Pricing 1: 1=3.99, 10=3.325, 100=2.66, 500=2.3275 (USD); Packaging: Cut Tape (CT); Part Status: Active; Input Type: Peak-Peak Signal; Voltage - Rated: 3V; Frequency: 4kHz; Technology: Magnetic; Operating Mode: Single Tone; Duration: -; Sound Pressure Level: 78dB @ 3V, 10cm; Operating Temperature: -30°C ~ 70°C; Approvals: -; Ratings: -; Mounting Type: Surface Mount; Termination: Solder Pads; Size / Dimension: 5.0mm L x 5.0mm W x 2.1mm H; Height - Seated (Max): *; ComponentLink1URL: http://www.puiaudio.com/pdf/SMT-0540-T-7-R.pdf; ComponentLink1Description: http://www.puiaudio.com/pdf/SMT-0540-T-7-R.pdf

## Sheet SAMD51.SchDoc
size A4
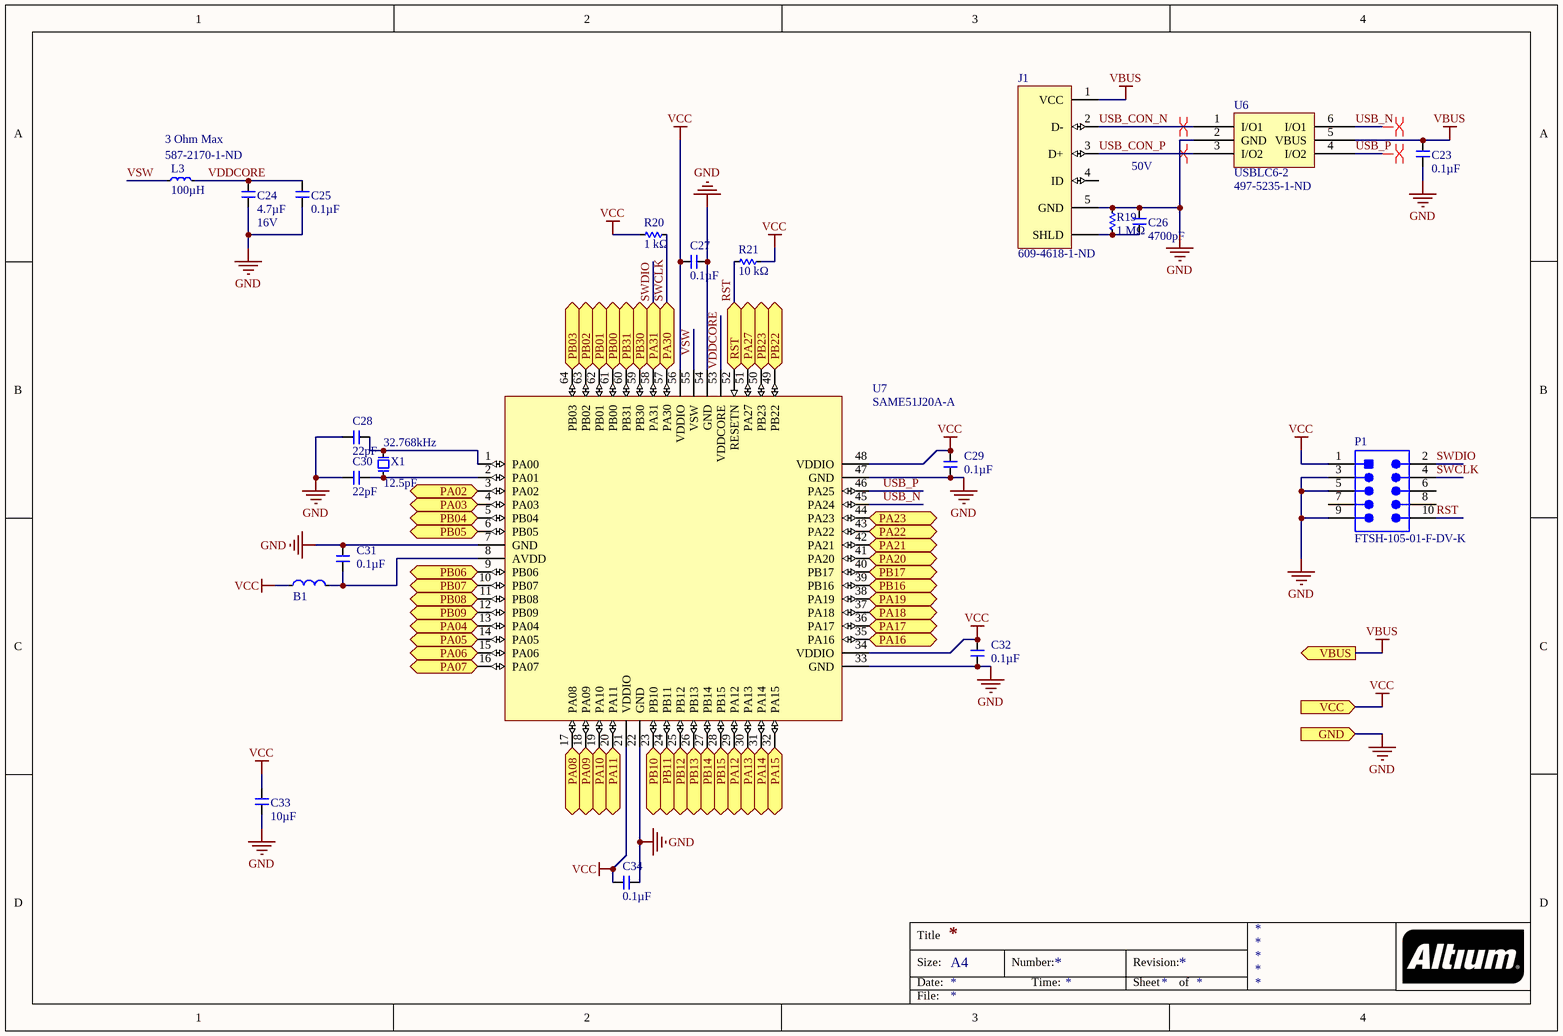
[diagram p4: SAMD51.SchDoc]

### Parts
B1  FB_1608  [R0603]  (value not drawn)
C23  Capacitance (shorthand): 0.1µF  [C0603]  (hidden comment: __template_cap)
C24  Capacitance (shorthand): 4.7µF  Rated Voltage: 16V  [C0603]  (hidden comment: __template_cap)
C25  Capacitance (shorthand): 0.1µF  [C0603]  (hidden comment: __template_cap)
C26  Capacitance (shorthand): 4700pF  Rated Voltage: 50V  [C0603]  (hidden comment: __template_cap)
C27  Capacitance (shorthand): 0.1µF  [C0603]  (hidden comment: __template_cap)
C28  Capacitance (shorthand): 22pF  [C0603]  (hidden comment: __template_cap)
C29  Capacitance (shorthand): 0.1µF  [C0603]  (hidden comment: __template_cap)
C30  Capacitance (shorthand): 22pF  [C0603]  (hidden comment: __template_cap)
C31  Capacitance (shorthand): 0.1µF  [C0603]  (hidden comment: __template_cap)
C32  Capacitance (shorthand): 0.1µF  [C0603]  (hidden comment: __template_cap)
C33  Capacitance (shorthand): 10µF  [C0603]  (hidden comment: __template_cap)
C34  Capacitance (shorthand): 0.1µF  [C0603]  (hidden comment: __template_cap)
J1  Supplier Part Number 1: 609-4618-1-ND  [CONN_USBMICROB_10118194-0001LF]  (hidden comment: CONN_USB_MICROB_SMD_TH_R/A)
L3  DC Resistance (DCR): 3 Ohm Max  Inductance: 100µH  Supplier Part Number 1: 587-2170-1-ND  [C1210]  (hidden comment: INDUCTOR 100UH 270MA 1210 SMD)
P1  FTSH-105-01-F-DV-K  [SMTC-FTSH-105-01-L-DV-K_V]
R19  Resistance: 1 MΩ  [R0603]  (hidden comment: __template_resistor)
R20  Resistance: 1 kΩ  [R0603]  (hidden comment: __template_resistor)
R21  Resistance: 10 kΩ  [R0603]  (hidden comment: __template_resistor)
U6  USBLC6-2  Supplier Part Number 1: 497-5235-1-ND  [6SOT23]
U7  SAME51J20A-A  [SAMD TQFP-64]
X1  Frequency: 32.768kHz  Load Capacitance: 12.5pF  [XTAL_TXC_9HT10]  (hidden comment: XTAL_9HT10-32.768KEZF-T)

### Ports
GND (in), PA02 (bidir), PA03 (bidir), PA04 (bidir), PA05 (bidir), PA06 (bidir), PA07 (bidir), PA08 (bidir), PA09 (bidir), PA10 (bidir), PA11 (bidir), PA12 (bidir), PA13 (bidir), PA14 (bidir), PA15 (bidir), PA16 (bidir), PA17 (bidir), PA18 (bidir), PA19 (bidir), PA20 (bidir), PA21 (bidir), PA22 (bidir), PA23 (bidir), PA27 (bidir), PA30 (bidir), PA31 (bidir), PB00 (bidir), PB01 (bidir), PB02 (bidir), PB03 (bidir), PB04 (bidir), PB05 (bidir), PB06 (bidir), PB07 (bidir), PB08 (bidir), PB09 (bidir), PB10 (bidir), PB11 (bidir), PB12 (bidir), PB13 (bidir), PB14 (bidir), PB15 (bidir), PB16 (bidir), PB17 (bidir), PB22 (bidir), PB23 (bidir), PB30 (bidir), PB31 (bidir), RST (bidir), VBUS (out), VCC (in)

### Nets
GND: C23.2 C24.1 C25.2 C26.1 C27.1 C28.1 C29.1 C30.1 C31.1 C32.1 C33.1 C34.2 J1.5(GND) P1.3 P1.5 P1.9 R19.2 U6.2(GND) U7.7(GND) U7.22(GND) U7.33(GND) U7.47(GND) U7.54(GND) ; port GND
VBUS: C23.1 J1.1(VCC) U6.5(VBUS) ; port VBUS
VCC: B1.1 C27.2 C29.2 C32.2 C33.2 C34.1 P1.1 R20.2 R21.2 U7.21(VDDIO) U7.34(VDDIO) U7.48(VDDIO) U7.56(VDDIO) ; port VCC  [project net 3V3]
ADXL_CS: U7.40(PB17) ; port PB17
ADXL_INT: U7.39(PB16) ; port PB16
ARM_RST: U7.25(PB12) ; port PB12
ARM_SCL: U7.30(PA13) ; port PA13
ARM_SDA: U7.29(PA12) ; port PA12
BAT_SNS_A: U7.63(PB02) ; port PB02
BMP_CS: U7.49(PB22) ; port PB22
BUSY: U7.9(PB06) ; port PB06
BUZZER: U7.61(PB00) ; port PB00
DIO1: U7.10(PB07) ; port PB07
DIO3: U7.12(PB09) ; port PB09
DIR_ARM1: U7.3(PA02) ; port PA02
DIR_ARM2: U7.6(PB05) ; port PB05
HEAT1: U7.5(PB04) ; port PB04
HEAT2: U7.4(PA03) ; port PA03
LED_3: U7.59(PB30) ; port PB30
LED_4: U7.60(PB31) ; port PB31
MISO: U7.13(PA04) ; port PA04
MOSI: U7.16(PA07) ; port PA07
NRESET: U7.11(PB08) ; port PB08
RF_CS: U7.42(PA21) ; port PA21
RF_MISO: U7.41(PA20) ; port PA20
RF_MOSI: U7.44(PA23) ; port PA23
RF_SCK: U7.43(PA22) ; port PA22
RST: P1.10 R21.1 U7.52(RESETN) ; port RST
SCK: U7.14(PA05) ; port PA05
SD_CLK: U7.24(PB11) ; port PB11
SD_CMD: U7.17(PA08) ; port PA08
SD_DAT0: U7.18(PA09) ; port PA09
SD_DAT1: U7.19(PA10) ; port PA10
SD_DAT2: U7.20(PA11) ; port PA11
SD_DAT3: U7.23(PB10) ; port PB10
SWCLK: P1.4 R20.1 U7.57(PA30) ; port PA30  [project net LED_1]
SWDIO: P1.2 U7.58(PA31) ; port PA31  [project net LED_2]
USB_CON_N: J1.2(D-) U6.1(I/O1)
USB_CON_P: J1.3(D+) U6.3(I/O2)
USB_N: U6.6(I/O1) U7.45(PA24)
USB_P: U6.4(I/O2) U7.46(PA25)
VDDCORE: C24.2 C25.1 L3.1 U7.53(VDDCORE)
VSW: L3.2 U7.55(VSW)
NetB1_2: B1.2 C31.2 U7.8(AVDD)
NetC26_2: C26.2 J1.SHIELD(SHLD) R19.1
NetC28_2: C28.2 U7.1(PA00) X1.2
NetC30_2: C30.2 U7.2(PA01) X1.1
NetU7_15: U7.15(PA06) ; port PA06
NetU7_26: U7.26(PB13) ; port PB13
NetU7_27: U7.27(PB14) ; port PB14
NetU7_28: U7.28(PB15) ; port PB15
NetU7_31: U7.31(PA14) ; port PA14
NetU7_32: U7.32(PA15) ; port PA15
NetU7_35: U7.35(PA16) ; port PA16
NetU7_36: U7.36(PA17) ; port PA17
NetU7_37: U7.37(PA18) ; port PA18
NetU7_38: U7.38(PA19) ; port PA19
NetU7_50: U7.50(PB23) ; port PB23
NetU7_51: U7.51(PA27) ; port PA27
NetU7_62: U7.62(PB01) ; port PB01
NetU7_64: U7.64(PB03) ; port PB03

Not connected (* = marked no-connect by the designer): J1 4(ID); P1 6 7 8

### Layout directives
differential pair: USB_CON_N, USB_CON_P, USB_N, USB_P

### Notes on the sheet
- Title
- Size:
- Date:
- A4
- Number:
- Time:
- Revision:
- Sheet
- of
- File:

### Library data of the parts
B1 = FB_1608: FERRITE BEAD 600 OHM 300mA; Manufacturer: Taiyo Yuden; Manufacturer Part Number: BK1608HW601-T; Number of Lines: 1; Impedance @ Frequency: 600 Ohm @ 100MHz; DC Resistance (DCR) (Max): 400 mOhm; Supplier 1: Digi-Key; Supplier Part Number 1: 587-1879-1-ND; RoHS: RoHS Compliant; Category: Filters; Stock 1: 11908; Pricing 1: 1=0.1, 10=0.059, 50=0.0474, 100=0.0426, 250=0.0312, 500=0.0227, 1000=0.02223 (USD); Packaging: Cut Tape (CT); Part Status: Active; Filter Type: -; Current Rating (Max): 300mA; Ratings: -; Operating Temperature: -55°C ~ 125°C; Package / Case: 0603 (1608 Metric); Mounting Type: Surface Mount; Height (Max): 0.037" (0.95mm); Size / Dimension: 0.063" L x 0.031" W (1.60mm x 0.80mm); ComponentLink1URL: http://ds.yuden.co.jp/TYCOMPAS/ut/detail.do?productNo=BK1608HW601-T&fileName=BK1608HW601-T_SS&mode=specSheetDownload; ComponentLink1Description: http://ds.yuden.co.jp/TYCOMPAS/ut/detail.do?productNo=BK1608HW601-T&fileName=BK1608HW601-T_SS&mode=specSheetDownload
C23 C25 C27 C29 C31 C32 C34 = 490-1519-1-ND: as C37 on sheet Delenda; Dielectric: X7R; Supplier 1: Digikey; Supplier Part Number 1: 490-1519-1-ND; Rated Voltage: 50V
C24 = 311-1785-1-ND: CAP CER 4.7UF 16V X5R 0603 10%; Manufacturer: Yageo; Capacitance - pF (Machine readable): #NAME?; type: capacitor; Dielectric: X5R; Supplier 1: Digikey; Supplier Part Number 1: 311-1785-1-ND
C26 = 490-1506-1-ND: CAP CER 0603 4700pF X7R 50V 10%; Manufacturer: Murata Electronics North America; Capacitance - pF (Machine readable): #NAME?; type: capacitor; Dielectric: X7R; Supplier 1: Digikey; Supplier Part Number 1: 490-1506-1-ND
C28 C30 = 490-1411-1-ND: CAP CER 22PF 50V C0G/NP0 0603; Manufacturer: Murata Electronics North America; Capacitance - pF (Machine readable): 22; type: capacitor; Dielectric: C0G, NP0; Rated Voltage: 50V; Supplier 1: Digikey; Supplier Part Number 1: 490-1411-1-ND
C33 = 490-13248-1-ND: as C39 on sheet Sensors; Dielectric: X5R; Supplier 1: Digikey; Supplier Part Number 1: 490-13248-1-ND; Rated Voltage: 35V
J1 = CONN_USB_MICROB_SMD_TH_R/A: CONN RCPT USB2.0 MICRO B SMD R/A; Manufacturer: Amphenol FCI; Manufacturer Part Number: 10118194-0001LF; Gender: Receptacle; Current Rating: 1.8A; Connector Type: USB,Receptacle; Number of Contacts: 5; Insulation Resistance: 1GR; Number of Ports: 1; Max Voltage Rating (AC): 100V; Pitch: 0.65mm; Supplier 1: Digi-Key; Stock 1: 180464; Pricing 1: 1=0.46, 10=0.437, 25=0.3744, 50=0.318, 100=0.3056, 250=0.2744, 500=0.262 (USD); Mount: Surface Mount,Horizontal; Contact Material: Copper Alloy; Contact Plating: Nickel,Gold; Number of Terminals: 5; Housing Material: Polymer; Colour: Black; Min Operating Temperature: -55°C; Max Operating Temperature: 85°C; Package Quantity: 9600; Packaging: Tape and Reel; Termination: Solder; Orientation: Right Angle; Length: 8.05mm; Depth: 5mm; Radiation Hardening: No; Lead Free: Lead Free; Flammability Rating: UL94 V-0; ComponentLink1URL: https://datasheet.ciiva.com/851/10118194-851110.pdf; ComponentLink1Description: https://datasheet.ciiva.com/851/10118194-851110.pdf; ComponentLink2URL: https://datasheet.ciiva.com/851/10118194-851111.pdf; ComponentLink2Description: https://datasheet.ciiva.com/851/10118194-851111.pdf; ComponentLink3URL: https://datasheet.ciiva.com/4598/10118194ac-197217-4598807.pdf; ComponentLink3Description: https://datasheet.ciiva.com/4598/10118194ac-197217-4598807.pdf; ComponentLink4URL: https://datasheet.ciiva.com/29907/10118194-29907230.pdf; ComponentLink4Description: https://datasheet.ciiva.com/29907/10118194-29907230.pdf; ComponentLink5URL: https://datasheet.ciiva.com/26945/getdatasheetpartid-418619-26945695.pdf; ComponentLink5Description: https://datasheet.ciiva.com/26945/getdatasheetpartid-418619-26945695.pdf
L3 = IND_BRL3225T101K: Manufacturer: Taiyo Yuden; Current - Temperature Rise: 250mA; Tolerance: ±10%; Shielding: Unshielded; Frequency - Self Resonant: 5MHz; Frequency - Test: 100kHz; Manufacturer Part Number: BRL3225T101K; RoHS: RoHS Compliant; Category: Inductors, Coils, Chokes; Current - Saturation: 270mA; Type: -; Q @ Freq: -; Applications: Power Supplies; Material - Core: -; Package / Case: 1210 (3225 Metric); Mounting Type: Surface Mount; Packaging: Cut Tape (CT); Operating Temperature: -40°C ~ 105°C; ComponentLink1URL: http://www.yuden.co.jp/ut/product/pdf/wound07_e.pdf; ComponentLink1Description: Datasheet; Current: 270mA; Supplier 1: Digi-Key; Stock 1: 84687; Pricing 1: 1=0.16, 10=0.155, 50=0.145, 100=0.1354, 500=0.10638, 1000=0.08704 (GBP)
P1 = CMP-2000-05352-1: Male Header, Pitch 1.27 mm, 2 x 5 Position, Height 6.12 mm, RoHS, Tube; Manufacturer: Samtec; Number of Positions: 10; Connector Type: Header,Shrouded; Number of Positions Loaded: All; Row Spacing: 0.050"(1.27mm); Fastening Type: -; Package Reference: FTSH-105-01-L-DV-K; Termination: Solder; Package URL: http://suddendocs.samtec.com/prints/ftsh-1xx-xx-xxx-dv-xxx-footprint.pdf; Number of Rows: 2; Contact Finish Thickness: 3µin(0.08µm); Contact Type: MalePin; Manufacturer URL: http://www.samtec.com/; Series: FTSH; Features: -; Contact Finish: Gold; Color: Black; Family: RectangularConnectors-Headers,MalePins; Datasheet URL: http://suddendocs.samtec.com/prints/ftsh-1xx-xx-xxx-dv-xxx-mkt.pdf; Package Description: Male Header, Pitch 1.27 mm, 2 x 5 Position, Height 5.97 mm, Tail Length 4.32 mm; Mounting Type: SurfaceMount; Datasheet Version: Rev. ET, 10/1995; Category: Connectors,Interconnects; Packaging: Tube; Contact Mating Length: 0.120"(3.05mm); Pitch: 0.050"(1.27mm)
R19 = 311-1.00MHRCT-ND: RES SMD 1M OHM 1% 1/10W 0603; Manufacturer Part Number: RC0603FR-071ML; Manufacturer: Yageo; Resistance (Sortable): 1000000; Power (Watts): 0.1W, 1/10W; Temperature Coefficient: ±100ppm/°C; Supplier 1: Digikey; Datasheets: http://www.yageo.com/documents/recent/PYu-RC_Group_51_RoHS_L_9.pdf; Image: //media.digikey.com/Renders/Yageo%20Renders/0603-(1608-Metric).jpg; Supplier Part Number 1: 311-1.00MHRCT-ND; Tolerance: ±1%; Operating Temperature: -55°C ~ 155°C
R20 = 311-1.00KHRCT-ND: RES SMD 1K OHM 1% 1/10W 0603; Manufacturer Part Number: RC0603FR-071KL; Manufacturer: Yageo; Resistance (Sortable): 1000; Power (Watts): 0.1W, 1/10W; Temperature Coefficient: ±100ppm/°C; Supplier 1: Digikey; Datasheets: http://www.yageo.com/documents/recent/PYu-RC_Group_51_RoHS_L_9.pdf; Image: //media.digikey.com/Renders/Yageo%20Renders/0603-(1608-Metric).jpg; Supplier Part Number 1: 311-1.00KHRCT-ND; Tolerance: ±1%; Operating Temperature: -55°C ~ 155°C
R21 = 311-10.0KHRCT-ND: as R1 on sheet Battery_Management; Supplier 1: Digikey; Datasheets: http://www.yageo.com/documents/recent/PYu-RC_Group_51_RoHS_L_9.pdf; Image: //media.digikey.com/Renders/Yageo%20Renders/0603-(1608-Metric).jpg; Supplier Part Number 1: 311-10.0KHRCT-ND; Tolerance: ±1%; Operating Temperature: -55°C ~ 155°C
U6 = USBLC6-2: Manufacturer: STMicroelectronics; Manufacturer Part Number: USBLC6-2SC6; Unidirectional Channels: 2; Voltage - Reverse Standoff (Typ): 5.25V; Voltage - Breakdown (Min): 6V; Voltage - Clamping (Max) @ Ipp: 17V; Current - Peak Pulse (10/1000µs): 5A (8/20µs); Power Line Protection: Yes; Supplier 1: Digi-Key; RoHS: RoHS Compliant; Category: Circuit Protection; Stock 1: 31719; Pricing 1: 1=0.51, 10=0.411, 100=0.2802, 500=0.21012, 1000=0.15759 (USD); Packaging: Cut Tape (CT); Part Status: Active; Type: Steering (Rail to Rail); Bidirectional Channels: -; Power - Peak Pulse: -; Applications: Ethernet; Capacitance @ Frequency: -; Operating Temperature: -40°C ~ 125°C (TJ); Mounting Type: Surface Mount; Package / Case: SOT-23-6; Supplier Device Package: SOT-23-6; ComponentLink1URL: http://www.st.com/web/en/resource/technical/document/datasheet/CD00050750.pdf; ComponentLink1Description: http://www.st.com/web/en/resource/technical/document/datasheet/CD00050750.pdf
U7 = SAME51J20A-A: Atmel SAM ARM Cortex M4; ComponentLink1Description: Product Page; ComponentLink1URL: https://www.microchip.com/wwwproducts/en/ATSAMD21G18; ComponentLink2Description: Datasheet; ComponentLink2URL: http://ww1.microchip.com/downloads/en/DeviceDoc/SAM-D21-Family-Datasheet-DS40001882C.pdf
X1 = XTAL_9HT10-32.768KEZF-T: CRYSTAL 32.768 KHZ 12.5 PF SMD; Manufacturer: TXC CORPORATION; Frequency Tolerance: ±10ppm; ESR (Equivalent Series Resistance): 70 kOhm; Operating Mode: Fundamental; Supplier 1: Digi-Key; Manufacturer Part Number: 9HT10-32.768KEZF-T; RoHS: RoHS Compliant; Category: Crystals and Oscillators; Stock 1: 5250; Pricing 1: 1=1.88, 10=1.625, 50=1.425, 100=1.125, 500=0.95, 1000=0.75 (USD); Type: kHz Crystal (Tuning Fork); Frequency Stability: -; Operating Temperature: -40°C ~ 85°C; Ratings: -; Mounting Type: Surface Mount; Package / Case: 2-SMD; Size / Dimension: 0.126" L x 0.059" W (3.20mm x 1.50mm); Height: 0.033" (0.85mm); Packaging: Cut Tape (CT); ComponentLink1URL: http://www.txccrystal.com/images/pdf/9ht10.pdf; ComponentLink1Description: Datasheet; Supplier Part Number 1: 887-1507-1-ND

## Sheet SD.SchDoc
size A4
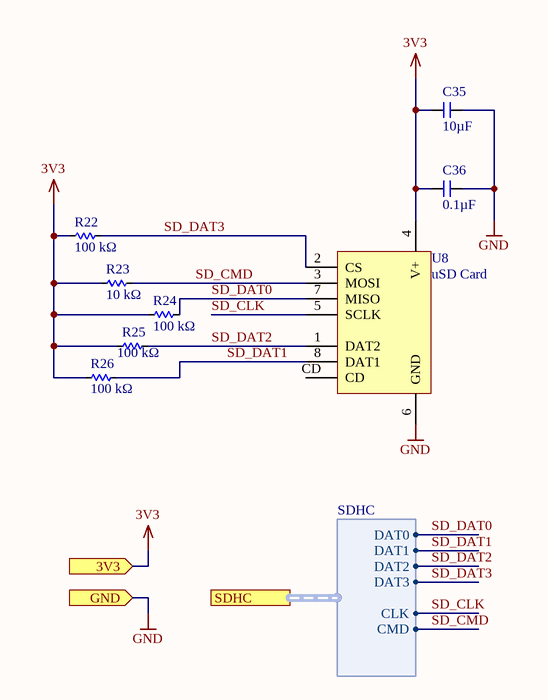
[diagram p5: SD.SchDoc]

### Parts
C35  Capacitance (shorthand): 10µF  [C0603]  (hidden comment: __template_cap)
C36  Capacitance (shorthand): 0.1µF  [C0603]  (hidden comment: __template_cap)
R22  Resistance: 100 kΩ  [R0603]  (hidden comment: __template_resistor)
R23  Resistance: 10 kΩ  [R0603]  (hidden comment: __template_resistor)
R24  Resistance: 100 kΩ  [R0603]  (hidden comment: __template_resistor)
R25  Resistance: 100 kΩ  [R0603]  (hidden comment: __template_resistor)
R26  Resistance: 100 kΩ  [R0603]  (hidden comment: __template_resistor)
U8  uSD Card  [MICROSD_CARD_SOCKET]

### Ports
3V3 (in), GND (in), SDHC (harness SDHC)

### Harnesses
SDHC: DAT3, DAT0, DAT2, DAT1, CLK, CMD

### Nets
3V3: C35.2 C36.1 R22.1 R23.1 R24.1 R25.1 R26.1 U8.4(V+) ; port 3V3
GND: C35.1 C36.2 U8.6(GND) ; port GND
SD_CLK: U8.5(SCLK) ; port SDHC.CLK
SD_CMD: R23.2 U8.3(MOSI) ; port SDHC.CMD
SD_DAT0: R24.2 U8.7(MISO) ; port SDHC.DAT0
SD_DAT1: R26.2 U8.8(DAT1) ; port SDHC.DAT1
SD_DAT2: R25.2 U8.1(DAT2) ; port SDHC.DAT2
SD_DAT3: R22.2 U8.2(CS) ; port SDHC.DAT3

Not connected (* = marked no-connect by the designer): U8 CD

### Notes on the sheet
- Title
- Size:
- Date:
- A4
- Number:
- Time:
- Revision:
- Sheet
- of
- File:

### Library data of the parts
C35 = 490-13248-1-ND: as C39 on sheet Sensors; Rated Voltage: 35V; Dielectric: X5R; Supplier 1: Digikey; Supplier Part Number 1: 490-13248-1-ND
C36 = 490-1519-1-ND: as C37 on sheet Delenda; Rated Voltage: 50V; Dielectric: X7R; Supplier 1: Digikey; Supplier Part Number 1: 490-1519-1-ND
R22 R24-R26 = 311-100KHRCT-ND: RES SMD 100K OHM 1% 1/10W 0603; Manufacturer Part Number: RC0603FR-07100KL; Manufacturer: Yageo; Resistance (Sortable): 100000; Power (Watts): 0.1W, 1/10W; Temperature Coefficient: ±100ppm/°C; Supplier 1: Digikey; Datasheets: http://www.yageo.com/documents/recent/PYu-RC_Group_51_RoHS_L_9.pdf; Image: //media.digikey.com/Renders/Yageo%20Renders/0603-(1608-Metric).jpg; Supplier Part Number 1: 311-100KHRCT-ND; Tolerance: ±1%; Operating Temperature: -55°C ~ 155°C
R23 = 311-10.0KHRCT-ND: as R1 on sheet Battery_Management; Supplier 1: Digikey; Datasheets: http://www.yageo.com/documents/recent/PYu-RC_Group_51_RoHS_L_9.pdf; Image: //media.digikey.com/Renders/Yageo%20Renders/0603-(1608-Metric).jpg; Supplier Part Number 1: 311-10.0KHRCT-ND; Tolerance: ±1%; Operating Temperature: -55°C ~ 155°C
U8 = MICRO_SD_CARD_HOLDER: MICROSD CARD HOLDER, PUSH-PUSH; pin to pad: 6>6+SHIELD1+SHIELD2+SHIELD3; Manufacturer: 3M; Manufacturer Part Number: 2908-05WB-MG; Card Type: Secure Digital - microSD™; Number of Positions: 10 (8 + 2); Connector Type: Connector and Ejector; Insertion, Removal Method: Push In, Push Out; Supplier 1: Digi-Key; RoHS: RoHS Compliant; Category: Connectors, Interconnects; Stock 1: 32313; Pricing 1: 1=3.6, 10=3.458, 25=3.1704, 50=3.0262, 100=2.882, 250=2.52176, 500=2.4497, 1000=2.08945 (USD); Packaging: Cut Tape (CT); Ejector Side: -; Mounting Type: Surface Mount, Right Angle; Features: Switch; Height Above Board: 0.073" (1.85mm); Mounting Feature: Normal, Standard - Top; Contact Finish: Gold; Contact Finish Thickness: 15µin (0.38µm); ComponentLink1URL: http://multimedia.3m.com/mws/media/416257O/3mtm-card-connector-microsdtm-2900-series-ts2197.pdf; ComponentLink1Description: http://multimedia.3m.com/mws/media/416257O/3mtm-card-connector-microsdtm-2900-series-ts2197.pdf; Supplier Part Number 1: 3M5607CT-ND

## Nets that join several sheets
3V3: Delenda (C37.1 C38.1 U9.13), Sensors (C40.1 C44.1 U11.1 U12.1), Battery_Management (8 pins), Blink_Blink_Beep_Boop (D6.2 U3.1), SAMD51 (13 pins), SD (8 pins)
GND: Delenda (7 pins), Sensors (15 pins), Battery_Management (17 pins), Blink_Blink_Beep_Boop (5 pins), SAMD51 (23 pins), SD (C35.1 C36.2 U8.6)
ADXL_CS: Sensors (U11.7), SAMD51 (U7.40)
ADXL_INT: Sensors (U11.8), SAMD51 (U7.39)
BMP_CS: Sensors (U12.6), SAMD51 (U7.49)
BUSY: Delenda (U9.16), SAMD51 (U7.9)
BUZZER: Blink_Blink_Beep_Boop (Q2.1), SAMD51 (U7.61)
DIO1: Delenda (U9.15), SAMD51 (U7.10)
DIO3: Delenda (U9.11), SAMD51 (U7.12)
LED_1: Blink_Blink_Beep_Boop (R11.1), SAMD51 (P1.4 R20.1 U7.57)
LED_2: Blink_Blink_Beep_Boop (R12.1), SAMD51 (P1.2 U7.58)
LED_3: Blink_Blink_Beep_Boop (R13.1), SAMD51 (U7.59)
LED_4: Blink_Blink_Beep_Boop (R14.1), SAMD51 (U7.60)
MISO: Sensors (U11.12 U12.5), SAMD51 (U7.13)
MOSI: Sensors (U11.13 U12.4), SAMD51 (U7.16)
NRESET: Delenda (U9.6), SAMD51 (U7.11)
RF_CS: Delenda (U9.5), SAMD51 (U7.42)
RF_MISO: Delenda (U9.2), SAMD51 (U7.41)
RF_MOSI: Delenda (U9.3), SAMD51 (U7.44)
RF_SCK: Delenda (U9.4), SAMD51 (U7.43)
SCK: Sensors (U11.14 U12.2), SAMD51 (U7.14)
SD_CLK: SAMD51 (U7.24), SD (U8.5)
SD_CMD: SAMD51 (U7.17), SD (R23.2 U8.3)
SD_DAT0: SAMD51 (U7.18), SD (R24.2 U8.7)
SD_DAT1: SAMD51 (U7.19), SD (R26.2 U8.8)
SD_DAT2: SAMD51 (U7.20), SD (R25.2 U8.1)
SD_DAT3: SAMD51 (U7.23), SD (R22.2 U8.2)